# Altium project ICM20602.PrjPCB
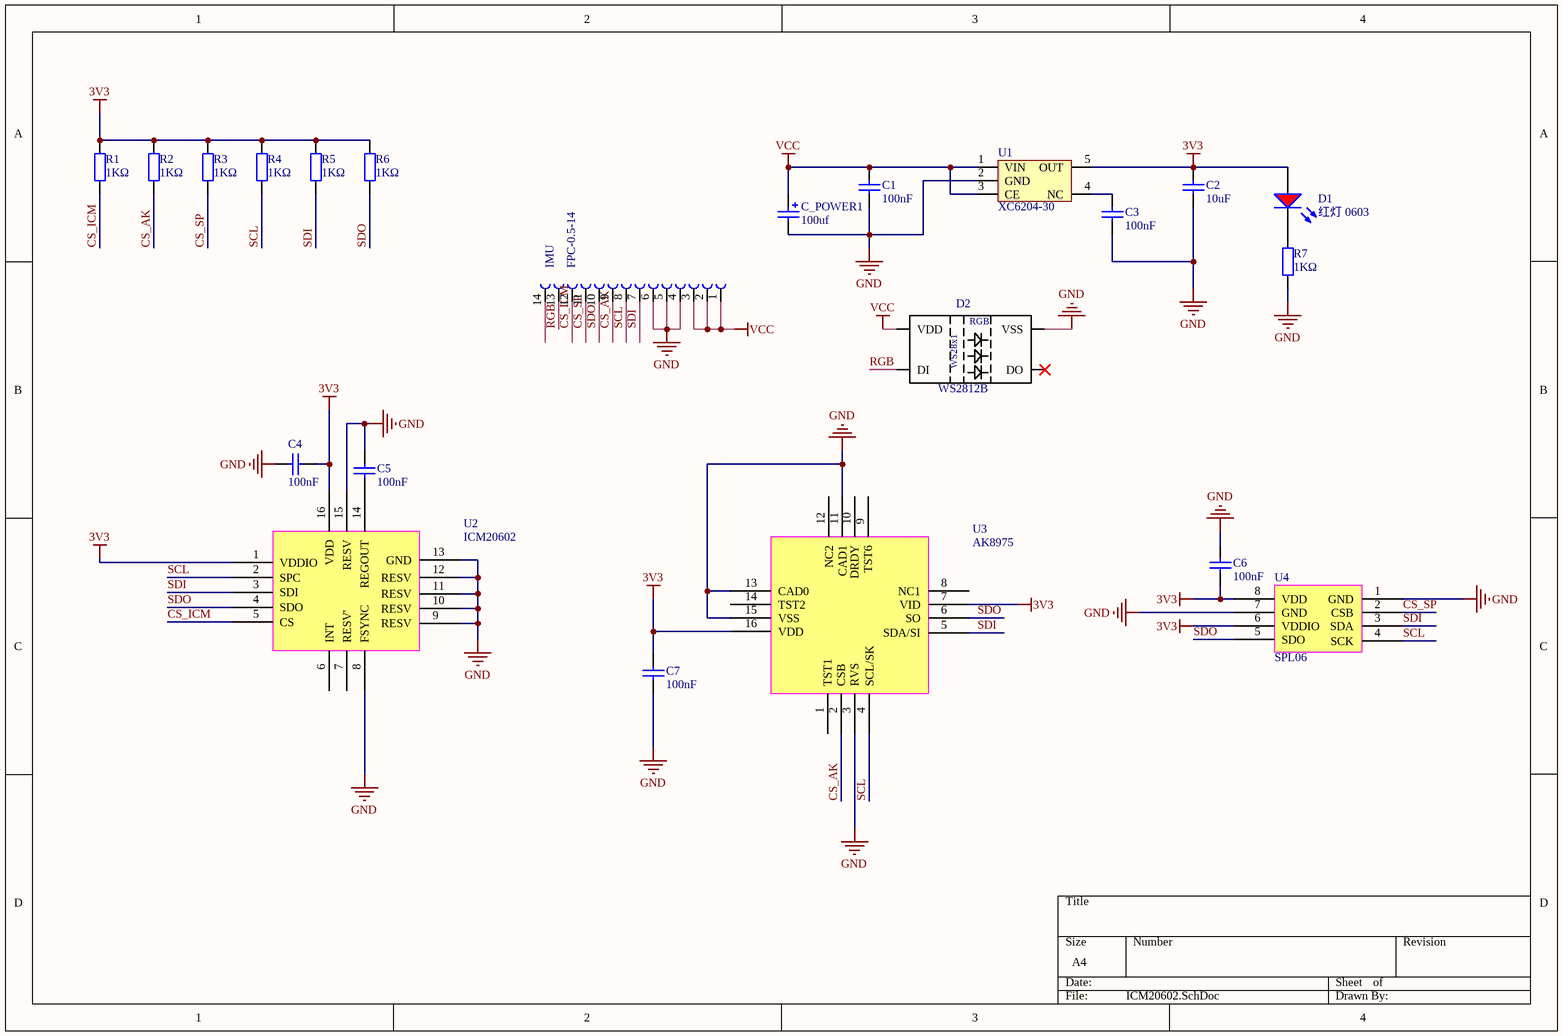
[diagram p0: ICM20602.SchDoc]
1 sheet, 22 parts. Net scope: global (net labels, ports and power ports of the same name join across sheets).
Board file: ICM20602.PcbDoc

## Sheet ICM20602.SchDoc
size A4

### Parts
C1  100nF  [0603_C]
C2  10uF  [0603_C]
C3  100nF  [0603_C]
C4  100nF  [0603_C]
C5  100nF  [0603_C]
C6  100nF  [0603_C]
C7  100nF  [0603_C]
C_POWER1  100uf  [C1206]
D1  红灯 0603  [0603_LED_S1]
D2  WS2812B  [WS2812B]
IMU  FPC-0.5-14  [FPC-0.5-14]
R1  1KΩ  [0603_R]
R2  1KΩ  [0603_R]
R3  1KΩ  [0603_R]
R4  1KΩ  [0603_R]
R5  1KΩ  [0603_R]
R6  1KΩ  [0603_R]
R7  1KΩ  [0603_R]
U1  XC6204-30  [SOT23-5S]
U2  ICM20602  [ICM20602]
U3  AK8975  [AK8975]
U4  SPL06  [LGA-2_5X2MM]

### Nets
3V3: C2.2 C4.2 C6.1 C7.2 D1.A R1.2 R2.2 R3.2 R4.2 R5.2 R6.2 U1.5(OUT) U2.1(VDDIO) U2.16(VDD) U3.7(VID) U3.16(VDD) U4.6(VDDIO) U4.8(VDD)
GND: C1.1 C2.1 C3.1 C4.1 C5.1 C6.2 C7.1 C_POWER1.2 D2.3(VSS) IMU.4 IMU.5 IMU.6 R7.1 U1.2(GND) U2.8(FSYNC) U2.9(RESV) U2.10(RESV) U2.11(RESV) U2.12(RESV) U2.13(GND) U2.15(RESV) U3.3(RVS) U3.11(CAD1) U3.13(CAD0) U3.15(VSS) U4.1(GND) U4.7(GND)
VCC: C1.2 C_POWER1.1 D2.1(VDD) IMU.1 IMU.2 IMU.3 U1.1(VIN) U1.3(CE)
CS_AK: IMU.9 R2.1 U3.2(CSB)
CS_ICM: IMU.12 R1.1 U2.5(CS)
CS_SP: IMU.11 R3.1 U4.2(CSB)
RGB: D2.4(DI) IMU.13
SCL: IMU.8 R4.1 U2.2(SPC) U3.4(SCL/SK) U4.4(SCK)
SDI: IMU.7 R5.1 U2.3(SDI) U3.5(SDA/SI) U4.3(SDA)
SDO: IMU.10 R6.1 U2.4(SDO) U3.6(SO) U4.5(SDO)
NetC3_2: C3.2 U1.4(NC)
NetC5_2: C5.2 U2.14(REGOUT)
NetD1_K: D1.K R7.2

Not connected (* = marked no-connect by the designer): D2 2(DO)*; IMU 14(1); U2 6(INT) 7(RESV'); U3 1(TST1) 8(NC1) 9(TST6) 10(DRDY) 12(NC2) 14(TST2)

### Notes on the sheet
- (in symbol WS2812B) RGB; WS28x1

### Library data of the parts
C1 C3-C7 = 0603 100nF (104) 10% 50V: 贴片电容; ComponentLink1Description: 供应商链接; ComponentLink1URL: http://www.szlcsc.com/product/details_15331.html; Package: 0603; Supplier: LC; SuppliersPartNumber: C14663
C2 = 0603 10uF (106) 10% 10V: 贴片电容; ComponentLink1Description: 供应商链接; ComponentLink1URL: http://www.szlcsc.com/product/details_20411.html; Package: 0603; Supplier: LC; SuppliersPartNumber: C19702
C_POWER1 = Cap Pol3: Polarized Capacitor (Surface Mount); Value: 10uf; Published: 8-Jun-2000; LatestRevisionDate: 17-Jul-2002; LatestRevisionNote: Re-released for DXP Platform.; PackageReference: C0805; Publisher: Altium Limited
D1 = 0603 红灯: 发光二极管; ComponentLink1Description: 供应商链接; ComponentLink1URL: http://www.szlcsc.com/product/details_2659.html; Package: 0603; Supplier: LC; SuppliersPartNumber: C2286
D2 = WS2812B: Intelligent Control Led Integrated Light Source Pack Of 10; MF: Seeed Technology; Price: None; MP: WS2812B; SnapEDA_Link: https://www.snapeda.com/parts/WS2812B/Seeed%20Technology%20Co.%2C%20Ltd/view-part/?ref=snap; Package: None; Availability: Unavailable; Value: *
IMU = FPC-0.5-14: FFC / FPC Board Connector, WR-FPC Series, Surface Mount, Receptacle, 14, Bottom, 0.5 mm; MP: 687114149022; MF: Wurth Electronics; SnapEDA_Link: https://www.snapeda.com/parts/687114149022/Wurth%20Electronics%20Inc./view-part/?ref=snap; Availability: Unavailable; Price: None; Package: None; Value: *
R1-R7 = 0603 1KΩ (1001) 1%: 贴片电阻; ComponentLink1Description: 供应商链接; ComponentLink1URL: http://www.szlcsc.com/product/details_21904.html; Package: 0603; Supplier: LC; SuppliersPartNumber: C21190
U1 = XC6204